# Altium project NodoFinalTBeam.PrjPcb
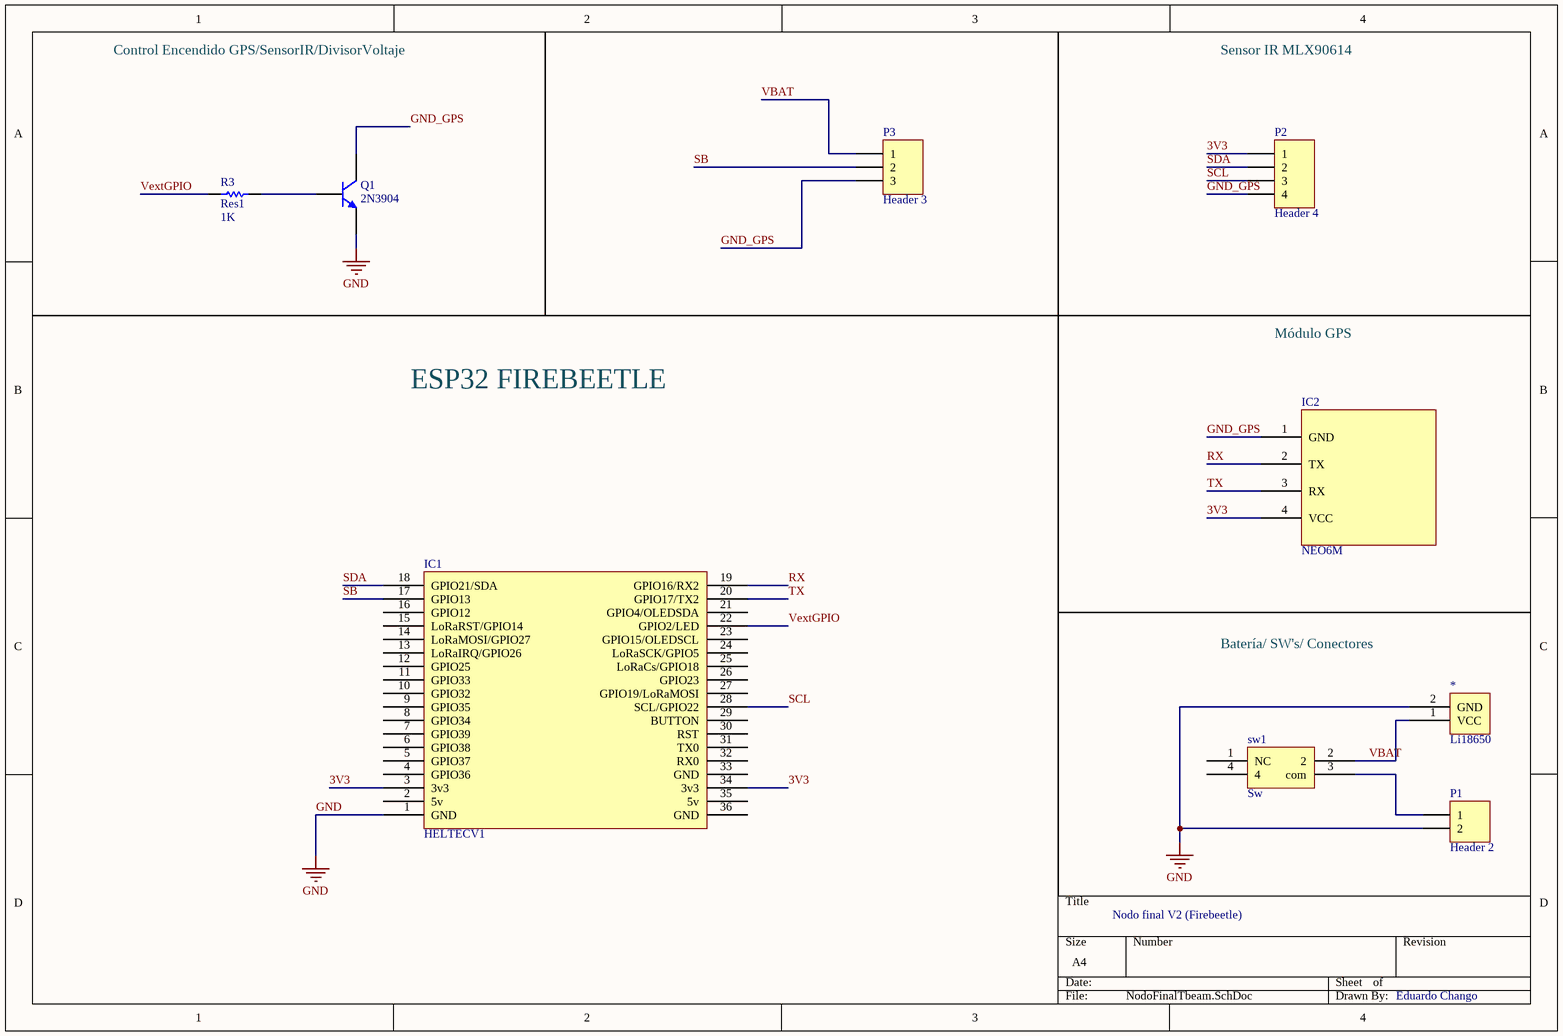
[diagram p0: NodoFinalTbeam.SchDoc]
1 sheet, 9 parts. Net scope: global (net labels, ports and power ports of the same name join across sheets).
Board file: NodoFinalTBeam.PcbDoc

## Sheet NodoFinalTbeam.SchDoc
size A4

### Parts
*  Li18650  [Li18650]
IC1  HELTECV1  [HELTECV1]
IC2  NEO6M  [NEO6M]
P1  Header 2  [HDR1X2]
P2  Header 4  [HDR1X4]
P3  Header 3  [HDR1X3]
Q1  2N3904  [TO-92A]
R3  Res1  value 1K  [AXIAL-0.3]
sw1  Sw  [InterruptorSMD]

### Nets
GND: *.2(GND) IC1.1(GND) P1.2 Q1.1(E)
3V3: IC1.3(3v3) IC1.34(3v3) IC2.4(VCC) P2.1
GND_GPS: IC2.1(GND) P2.4 P3.3 Q1.3(C)
RX: IC1.19(GPIO16/RX2) IC2.2(TX)
SB: IC1.17(GPIO13) P3.2
SCL: IC1.28(SCL/GPIO22) P2.3
SDA: IC1.18(GPIO21/SDA) P2.2
TX: IC1.20(GPIO17/TX2) IC2.3(RX)
VBAT: *.1(VCC) P3.1 sw1.2
VextGPIO: IC1.22(GPIO2/LED) R3.2
NetP1_1: P1.1 sw1.3(com)
NetQ1_2: Q1.2(B) R3.1

Not connected (* = marked no-connect by the designer): IC1 2(5v) 4(GPIO36) 5(GPIO37) 6(GPIO38) 7(GPIO39) 8(GPIO34) 9(GPIO35) 10(GPIO32) 11(GPIO33) 12(GPIO25) 13(LoRaIRQ/GPIO26) 14(LoRaMOSI/GPIO27) 15(LoRaRST/GPIO14) 16(GPIO12) 21(GPIO4/OLEDSDA) 23(GPIO15/OLEDSCL) 24(LoRaSCK/GPIO5) 25(LoRaCs/GPIO18) 26(GPIO23) 27(GPIO19/LoRaMOSI) 29(BUTTON) 30(RST) 31(TX0) 32(RX0) 33(GND) 35(5v) 36(GND); sw1 1(NC) 4

### Notes on the sheet
- Control Encendido GPS/SensorIR/DivisorVoltaje
- Sensor IR MLX90614
- Módulo GPS
- ESP32 FIREBEETLE
- Batería/ SW's/ Conectores
- Nodo final V2 (Firebeetle)
- Eduardo Chango

### Library data of the parts
IC1 = HELTECV1: ESP32 LORA BASED MCU
IC2 = NEO6M: GPS NEO6M
P1 = Header 2: Header, 2-Pin; LatestRevisionDate: 17-Jul-2002; LatestRevisionNote: Re-released for DXP Platform.; Publisher: Altium Limited
P2 = Header 4: Header, 4-Pin; LatestRevisionDate: 17-Jul-2002; LatestRevisionNote: Re-released for DXP Platform.; Publisher: Altium Limited
P3 = Header 3: Header, 3-Pin; LatestRevisionDate: 17-Jul-2002; LatestRevisionNote: Re-released for DXP Platform.; Publisher: Altium Limited
Q1 = 2N3904: NPN General Purpose Amplifier; Published: 8-Jun-2000; LatestRevisionDate: 15-Jan-2003; LatestRevisionNote: PCB Footprint 'BCY-W3/D4.7' replaced; DatasheetVersion: 1997; PackageVersion: Sep-1998; PackageReference: TO-92A; Publisher: Altium Limited; PackageDescription: TO, Flat Index; 3 In-Line, Axial Leads; Body Dia. 4.5mm; Leads 0.51 x 0.48 mm (max); ComponentLink1Description: Manufacturer Link; ComponentLink1URL: http://www.fairchildsemi.com/; ComponentLink2Description: Datasheet; ComponentLink2URL: http://www.fairchildsemi.com/ds/2N%2F2N3904.pdf
R3 = Res1: Resistor; Published: 8-Jun-2000; LatestRevisionDate: 17-Jul-2002; LatestRevisionNote: Re-released for DXP Platform.; PackageReference: AXIAL-0.3; Publisher: Altium Limited; PackageDescription: Axial Device, Thru-Hole; 2 Leads; 0.3 in Pin Spacing